# EAGLE design sensors_sht4x_sgp4x_bme68x (EAGLE 9.6.2)
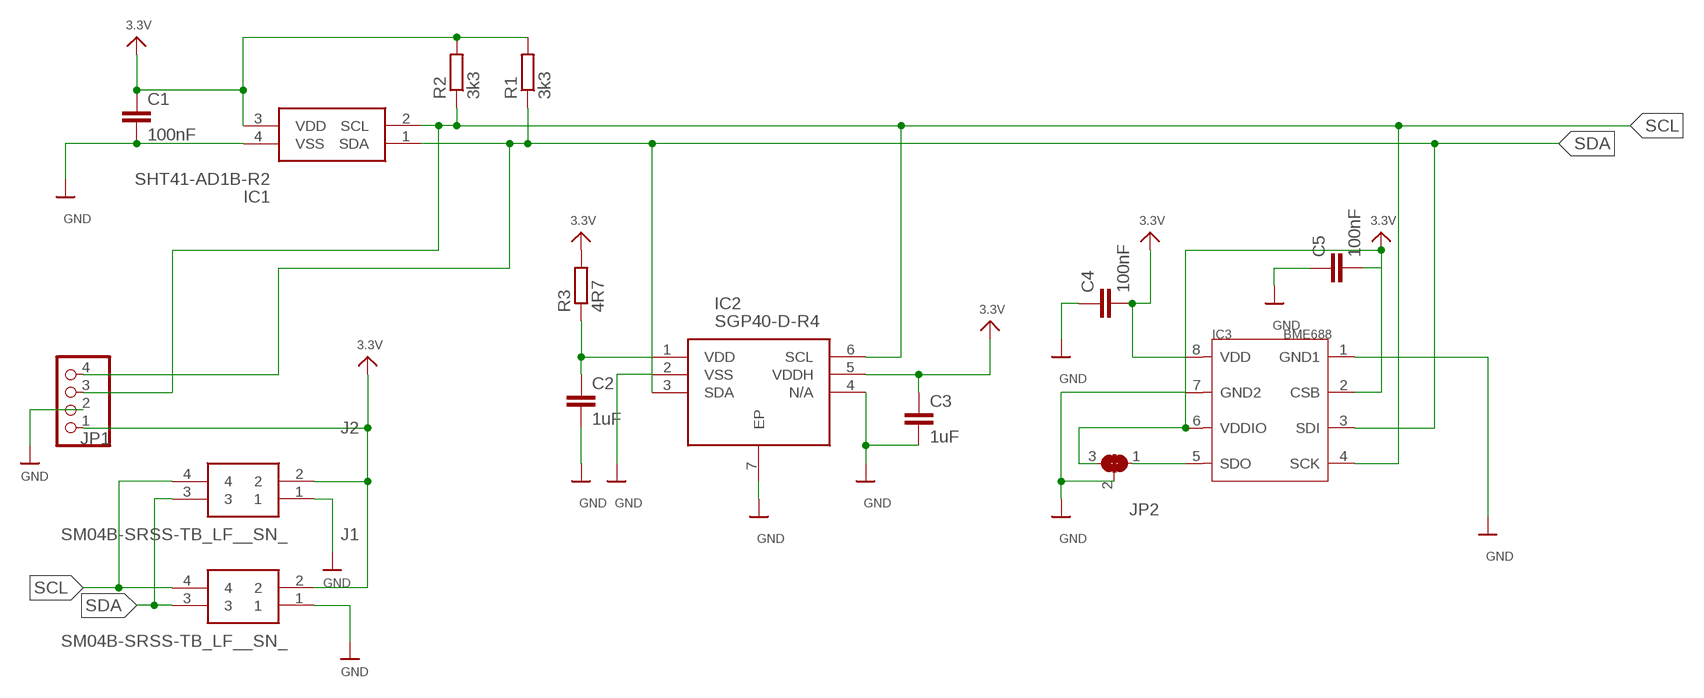
[diagram p0: schematic, sheet 1]

## Parts
C1  100nF  C-EUC0805  [C0805]
C2  1uF  C-EUC0805  [C0805]
C3  1uF  C-EUC0805  [C0805]
C4  100nF  C-EUC0805  [C0805]
C5  100nF  C-EUC0805  [C0805]
IC1  SHT41-AD1B-R2  [SHT41AD1BR2]
IC2  SGP40-D-R4  [SON80P244X244X95-7N]
IC3  BME688  [SNR8-0.8-3X3X0.93MM]
J1  SM04B-SRSS-TB_LF__SN_  [SM04B-SRSS-TB(LFSN)]
J2  SM04B-SRSS-TB_LF__SN_  [SM04B-SRSS-TB(LFSN)]
JP1  PINHD-1X4  [1X04]
JP2  SOLDERJUMPER_2WAY0603  [SOLDERJUMPER_2WAY_OPEN_0603]
R1  3k3  R-EU_R0805  [R0805]
R2  3k3  R-EU_R0805  [R0805]
R3  4R7  R-EU_R0805  [R0805]

## Nets
3.3V: C1.1 C3.1 C4.2 C5.2 IC1.3(VDD) IC2.5(VDDH) IC3.2(CSB) IC3.6(VDDIO) IC3.8(VDD) J1.2 J2.2 JP1.1 JP2.3 R1.2 R2.2 R3.2
GND: C1.2 C2.2 C3.2 C4.1 C5.1 IC1.4(VSS) IC2.2(VSS) IC2.4(N/A) IC2.7(EP) IC3.1(GND1) IC3.7(GND2) J1.1 J2.1 JP1.2 JP2.2
N$1: C2.1 IC2.1(VDD) R3.1
N$2: IC3.5(SDO) JP2.1
SCL: IC1.2(SCL) IC2.6(SCL) IC3.4(SCK) J1.4 J2.4 JP1.3 R2.1
SDA: IC1.1(SDA) IC2.3(SDA) IC3.3(SDI) J1.3 J2.3 JP1.4 R1.1

## Library data of the parts
C1-C5 = rcl:C-EU: CAPACITOR, European symbol; SPICEPREFIX: C
IC1 = SamacSys_Parts:SHT41-AD1B-R2: Board Mount Humidity Sensors Intermediate Humidity and Temperature Sensor Source: Datasheet <https://sensirion.com/media/documents/33FD6951/61641E1E/Sensirion_Humidity_Sensors_SHT4x_Datasheet.pdf>; DESCRIPTION: Board Mount Humidity Sensors Intermediate Humidity and Temperature Sensor; HEIGHT: 0.59mm; MANUFACTURER_NAME: Sensirion; MANUFACTURER_PART_NUMBER: SHT41-AD1B-R2
IC2 = SamacSys_Parts:SGP40-D-R4: Air Quality Sensors Gas Sensor 2.5k pcs IC Source: Datasheet; DESCRIPTION: Air Quality Sensors Gas Sensor 2.5k pcs IC; HEIGHT: 0.95mm; MANUFACTURER_NAME: Sensirion; MANUFACTURER_PART_NUMBER: SGP40-D-R4
IC3 = SamacSys_Parts:BME688
J1 J2 = SamacSys_Parts:SM04B-SRSS-TB_LF__SN_: JST (JAPAN SOLDERLESS TERMINALS) - SM04B-SRSS-TB(LF)(SN) - CONNECTOR, HEADER, SMT, R/A, 1MM, 4WAY Source: Datasheet <http://www.jst-mfg.com/product/pdf/eng/eSH.pdf>; DESCRIPTION: JST (JAPAN SOLDERLESS TERMINALS) - SM04B-SRSS-TB(LF)(SN) - CONNECTOR, HEADER, SMT, R/A, 1MM, 4WAY; HEIGHT: mm; MANUFACTURER_NAME: JST (JAPAN SOLDERLESS TERMINALS); MANUFACTURER_PART_NUMBER: SM04B-SRSS-TB(LF)(SN)
JP1 = pinhead_dmx:PINHD-1X4: PIN HEADER
JP2 = microbuilder:SOLDERJUMPER_2WAY: 2-Way Solder Jumper
R1-R3 = rcl:R-EU_: RESISTOR, European symbol; SPICEPREFIX: R

## Board
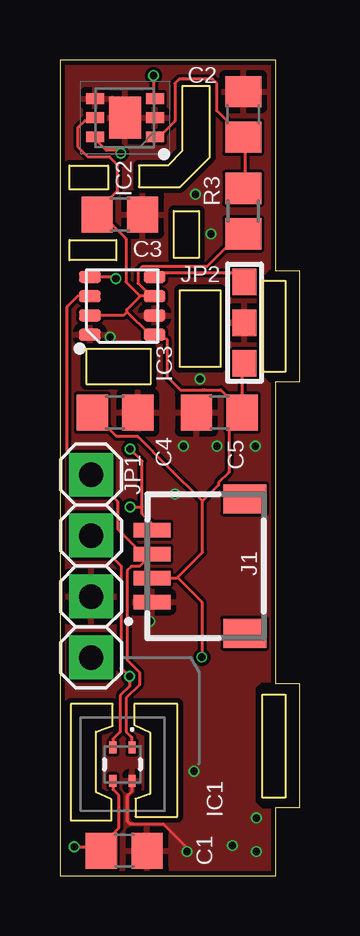
[diagram p1: board, top side]
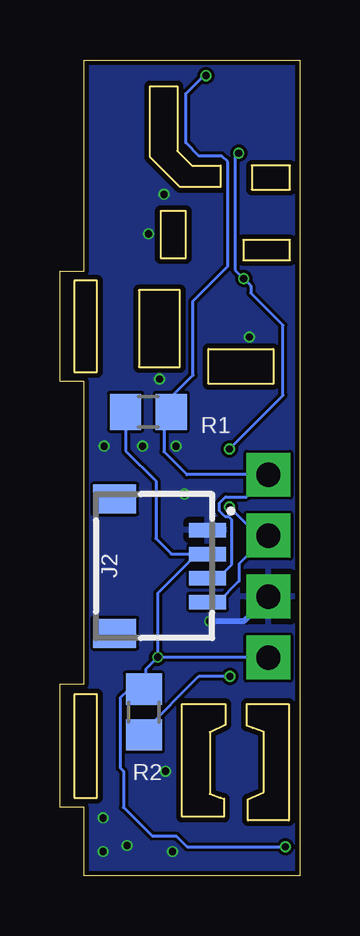
[diagram p2: board, bottom side, seen from below]

Size 10 x 34 mm. Coordinates in mm from the lower left corner, seen from the top.
Outline: 0,0 9,0 9,2.85 10,2.85 10,8 9,8 9,20.6 10,20.6 10,25.2 9,25.2 9,34 0,34 0,0
Outline: 2,28.6 0.4,28.6 0.4,29.6 2,29.6 2,28.6
Outline: 3.3,29.6 3.3,28.7 5,28.7 6.25,29.95 6.25,32.9 5.1,32.9 5.1,30.2 4.5,29.6 3.3,29.6
Outline: 5.8,27.7 5.8,25.75 4.75,25.75 4.75,27.7 5.8,27.7
Outline: 2.35,25.65 0.4,25.65 0.4,26.5 2.35,26.5 2.35,25.65
Outline: 6.7,21.2 5,21.2 5,24.4 6.7,24.4 6.7,21.2
Outline: 1.1,21.95 1.1,20.5 3.8,20.5 3.8,21.95 1.1,21.95
Outline: 0.45,7.15 0.45,2.3 2.15,2.3 2.15,3.18 1.5,3.48 1.5,6 1.95,6.15 2.2,6.25 2.2,7.15 0.45,7.15
Outline: 4.9,2.45 4.9,7.15 3.1,7.15 3.1,6.27 3.75,5.97 3.75,3.4 3.3,3.25 3.15,3.2 3.15,2.45 4.9,2.45
Outline: 9.4,7.55 9.4,3.25 8.45,3.25 8.45,7.55 9.4,7.55
Outline: 9.4,24.8 9.4,21 8.45,21 8.45,24.8 9.4,24.8
Copper layers (1*16): Top 0.035mm / dielectric 1.6mm / Bottom 0.035mm
Design rules "jlcpcb-2layers": minimum track width 5mil, minimum drill 0.3mm, track to track 5mil, track to pad 5mil, pad to pad 5mil, via to via 5mil, smd to smd 5mil, copper to edge 0.2mm, drill to drill 6mil, minimum pad ring 10mil, minimum via ring 3mil, stop-mask expansion 4mil, vias tented up to drill 0mil, thermal gap 10mil
tRestrict: area 8.2,2.9 to 10,8; area 8.2,2.9 to 10,8; area 8.4,20.6 to 10,25.2; area 8.4,20.6 to 10,25.2

### Footprints (pad centres in the part's own frame; a part is rotated, then mirrored left to right if it is on the bottom)
C0805 = smd 1.3 x 1.5: 1 -0.95,0; 2 0.95,0
SHT41AD1BR2 = smd 0.5 x 0.3: 1 -0.7,0.4; 2 -0.7,-0.4; 3 0.7,-0.4; 4 0.7,0.4
SON80P244X244X95-7N = smd 0.75 x 0.45: 1 -1.25,0.8; 2 -1.25,0; 3 -1.25,-0.8; 4 1.25,-0.8; 5 1.25,0; 6 1.25,0.8 | smd 1.35 x 1.74: 7 0,0
SNR8-0.8-3X3X0.93MM = smd 0.9 x 0.5: 1 1.35,1.2; 2 1.35,0.4; 3 1.35,-0.4; 4 1.35,-1.2; 5 -1.35,-1.2; 6 -1.35,-0.4; 7 -1.35,0.4; 8 -1.35,1.2
SM04B-SRSS-TB(LFSN) = smd 0.6 x 1.55: 1 1.5,4.661; 2 2.5,4.661; 3 3.5,4.661; 4 4.5,4.661 | smd 1.2 x 1.8: 5 0.2,0.786; 6 5.8,0.786
1X04 = drill 1.016 square: 1 -3.81,0; 2 -1.27,0; 3 1.27,0; 4 3.81,0
SOLDERJUMPER_2WAY_OPEN_0603 = smd 1.1 x 1: 1 -1.7,0; 2 0,0; 3 1.7,0
R0805 = smd 1.3 x 1.5: 1 -0.95,0; 2 0.95,0

### Placement (x,y rotation side)
C1  2.68,1.04 0 top
C2  7.65,31.73 90 top
C3  2.5,27.55 0 top
C4  2.3,19.3 180 top
C5  6.65,19.3 0 top
IC1  2.61,4.64 270 top
IC2  2.72,31.59 180 top
IC3  2.6,23.75 180 top
J1  8.5,9.9 90 top
J2  8.5,15.9 270 bottom
JP1  1.3,12.9 90 top
JP2  7.7,23.05 270 top
R1  6.31,19.33 180 bottom
R2  6.5,6.82 90 bottom
R3  7.65,27.7 270 top

### Tracks (layer width: path | path; a pad name or v marks a point on that pad's centre or on a via)
3.3V  (via drill 0.3)
  Top 0.127: IC2.5 1.45,31.48 1.04,31.48 0.76,31.19 0.76,30.36 1.17,29.95 2.08,29.95 2.41,29.62 2.41,28.54 1.65,27.78 1.65,27.58 C3.1 1.75,27.55 2.75,26.55 2.75,24.75 3,24.5 3.35,24.15 | IC1.3 2.21,3.59 2.46,3.34 2.46,2 1.68,1.21 1.73,1.16 | C1.1 1.78,1.11 1.73,1.16 | 2.8,23.5 3.75,22.55 IC3.8 4.47,22.34 4.47,20.8 5.03,20.24 5.95,20.24 6.05,20.24 6.71,20.24 7.6,19.35 | C4.2 1.4,19.27 2.36,18.3 3.25,18.3 3.3,18.25 4.48,17.08 5.95,15.61 | 3.35,24.15 IC3.6 3.8,24.15 3.26,24.69 3.26,25.21 3.45,25.4 6.15,25.4 7.55,26.8 7.6,26.8 R3.2 | 3.35,24.15 3.3,24.1 2.8,23.6 2.8,23.5 | 2.8,23.5 2.65,23.35 IC3.2 | J1.2 4.87,12.4 4.9,12.43 | v5.92,9.1 5.92,11.4 4.9,12.43 | 4.9,12.43 5.95,13.48 5.95,15.61 | 5.95,15.61 5.96,15.61 6.62,16.27 6.62,16.38 7.05,16.8 7.05,18.75 C5.2 7.6,19.35 | JP2.3 7.6,21.25 7.6,19.35 | v0.6,1.2 1.69,1.2 1.73,1.16
  Bottom 0.127: v5.92,9.1 6.42,8.6 6.42,7.84 R2.2 7.11,7.77 7.49,7.4 7.49,4.49 7.35,4.35 7.35,2.84 6.16,1.65 5.15,1.65 4.7,1.2 v0.6,1.2 | v5.92,9.1 5.92,11.76 4.28,13.4 J2.2 5.35,13.4 6,14.05 6,16.45 7.26,17.71 R1.2 | JP1.1 5.91,9.09 v5.92,9.1
GND  (via drill 0.3)
  Top 0.127: v5.3,1 5.3,1.15 4.3,2.15 2.92,2.15 2.82,2.25 2.82,3.33 3.01,3.52 IC1.4
  Bottom 0.254: JP1.2 2.33,10.6 v3.75,10.6
  other vias: 8.15,17.9 6.55,17.9 5.15,17.9 6.3,26.75 5.65,28.4 7.2,1.25 8.2,2.4 8.2,1 4.8,15.9 5.85,20.7 2.1,22.45 5.6,4.35
  pour Bottom: 0,33.95 9,33.95 9,-0.05 0,-0.05
  pour Top: 0,34 9,34 9,0 0,0
N$1
  Top 0.127: R3.1 7.75,28.67 7.75,30.7 C2.1 6.55,31.88 6.55,33.02 6.38,33.2 4.97,33.2 4.8,33.02 4.8,31.45 4.14,30.79 IC2.1
N$2
  Top 0.127: JP2.1 7.33,25.12 4.12,25.12 IC3.5
SCL  (via drill 0.3)
  Top 0.127: IC1.2 2.21,5.69 2.51,5.99 2.51,7.5 2.9,7.89 v2.9,8.3 2.55,8.65 2.55,12.91 1.4,14.06 JP1.3 | J1.4 3.81,14.45 3.81,14.7 3.43,15.08 3.43,15.37 | 3.43,15.37 3.43,17.27 v2.92,17.78 | v2.54,30.11 2.41,30.24 1.93,30.24 1.53,30.64 IC2.6 | v2.92,15.37 3.43,15.37 | v2.33,24.89 2.27,24.95 IC3.4
  Bottom 0.127: v2.54,30.11 2.69,29.96 2.69,25.24 v2.33,24.89 2.03,24.59 2.03,24.28 0.69,22.94 0.69,20.01 v2.92,17.78 | v2.92,15.37 1.65,14.1 1.4,14.1 JP1.3 1.35,14.17 2.52,13 2.52,12.27 3.4,11.4 J2.4 | v2.9,8.3 4.21,8.3 6.5,6.02 R2.1
SDA  (via drill 0.3)
  Top 0.127: 3.3,13.3 3.81,13.3 J1.3 | IC1.1 2.99,5.35 2.99,5.77 2.77,5.99 2.77,7.4 3.32,7.95 3.32,8.47 2.8,8.98 2.8,12.71 2.98,12.89 3.33,12.89 J1.3 | IC3.3 0.74,24.15 0.31,23.72 0.31,17.69 1.27,16.73 JP1.4 1.4,16.6 2.41,15.59 2.41,14.45 3.3,13.56 3.3,13.3 | 3.3,13.3 J1.3 | v3.9,33.35 3.9,32.46 IC2.3
  Bottom 0.127: v3.9,33.35 4,33.25 4.1,33.25 4.75,32.6 4.75,30.55 4.2,30 3.24,30 2.99,29.75 2.99,25.4 4.45,23.95 4.45,20.86 5.36,19.94 R1.1 5.66,19.03 5.66,17.67 4.7,16.71 JP1.4 2.23,15.78 3.09,15.78 3.34,15.54 3.34,15.19 3.09,14.95 2.94,14.95 2.82,14.83 2.82,12.97 3.4,12.4 J2.3

### Text on the board
tDocu: SGP | BME | SCL / SDA / 3V3 / GND | SDA / SCL / GND / 3V3 | SHT
bDocu: bb_3xsensors / v1.0 beta | selfbus.org | GND / 3V3 / SDA / SCL